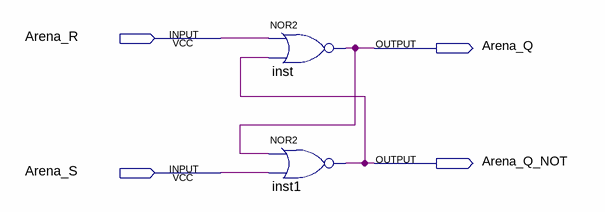
[diagram p0: schematic sheet]
// Quartus schematic Arena_SRLatch.bdf as structural Verilog: 2 symbols, 4 pins
module Arena_SRLatch (
  input  Arena_R,
  input  Arena_S,
  output Arena_Q,
  output Arena_Q_NOT
);

  nor inst (Arena_Q, Arena_R, Arena_Q_NOT);
  nor inst1 (Arena_Q_NOT, Arena_Q, Arena_S);
endmodule
